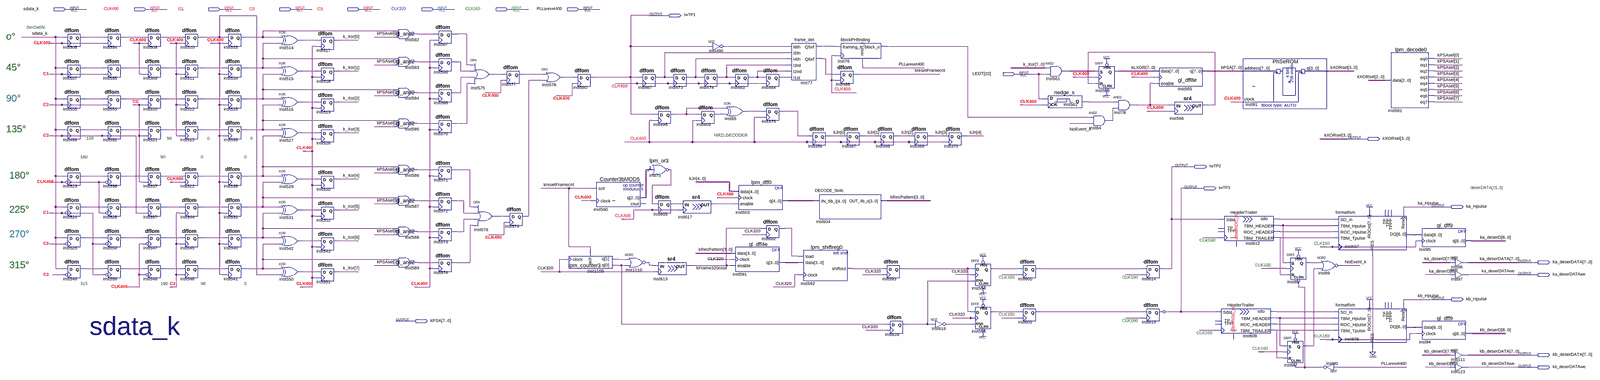
[diagram p0: schematic sheet, whole]
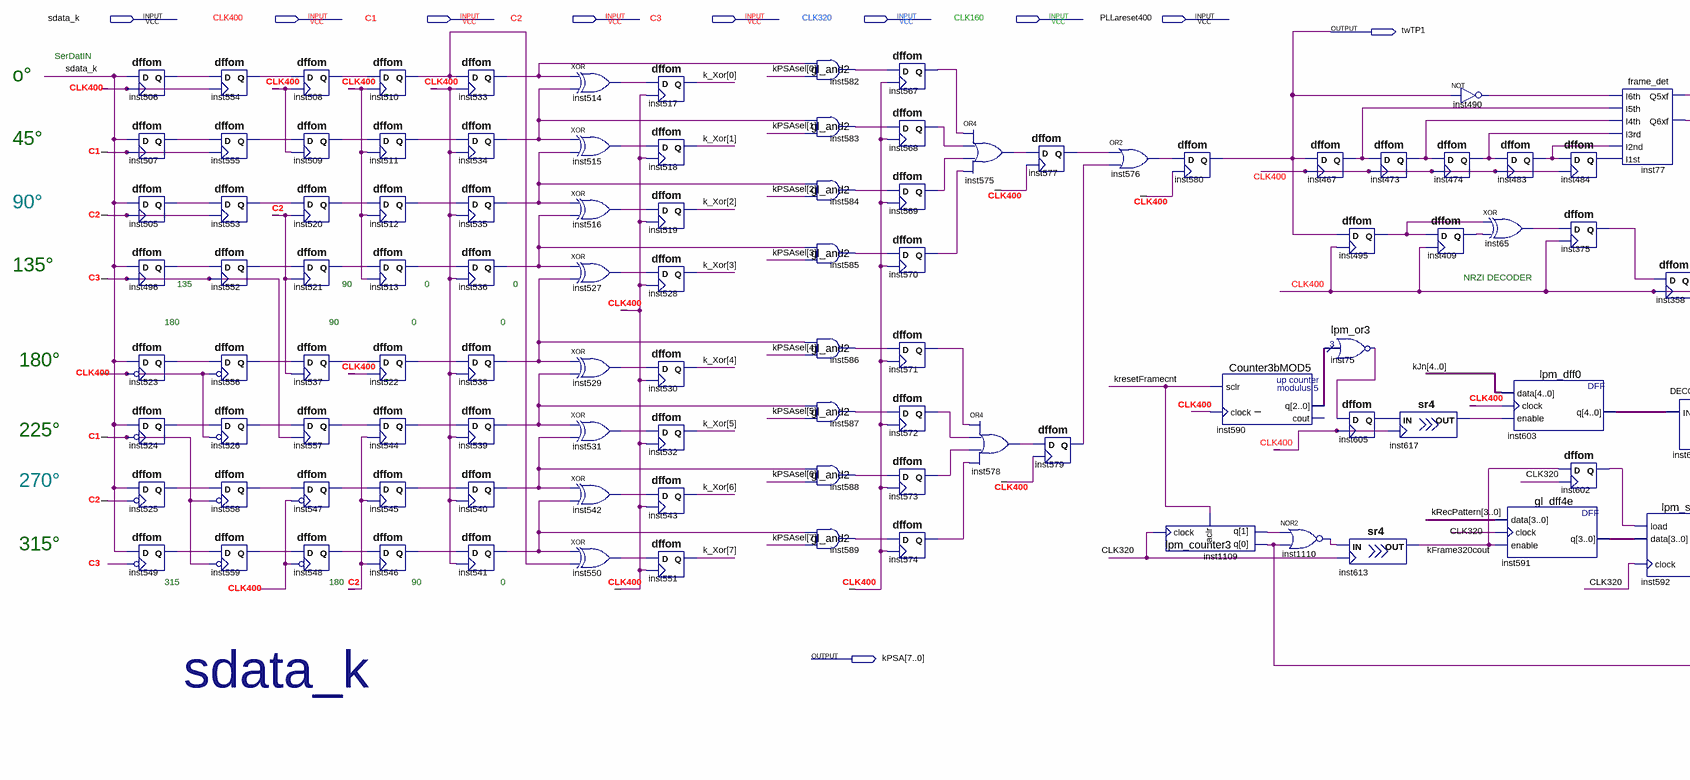
[diagram p1: schematic sheet, left part]
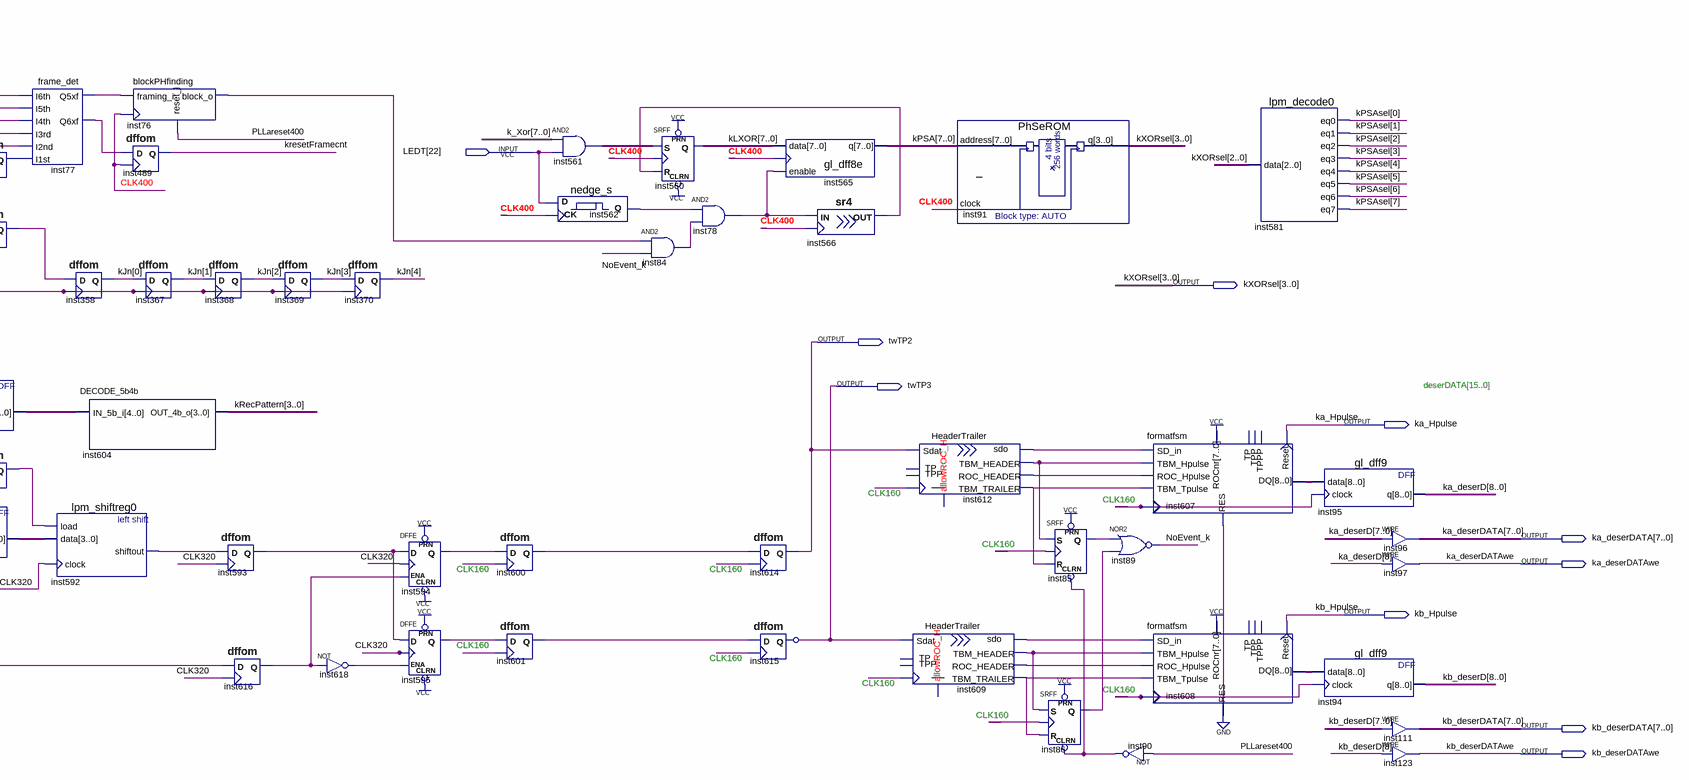
[diagram p2: schematic sheet, right part]
// Quartus schematic deser400_inst_k.bdf as structural Verilog: 140 symbols, 20 pins
module deser400_inst_k (
  input  sdata_k,
  input  CLK400,
  input  C1,
  input  C2,
  input  C3,
  input  CLK320,
  input  CLK160,
  input  PLLareset400,
  input  [22:22] LEDT,
  output twTP1,
  output [3:0] kXORsel,
  output twTP2,
  output twTP3,
  output ka_Hpulse,
  output [7:0] ka_deserDATA,
  output ka_deserDATAwe,
  output kb_Hpulse,
  output [7:0] kPSA,
  output [7:0] kb_deserDATA,
  output kb_deserDATAwe
);

  wire inst65_out, inst75_result, inst75_result_inverted_out, inst76_block_o, inst77_q5xf, inst77_q6xf,
       inst78_out, inst84_out, inst85_q, inst86_q, inst90_out, inst375_q, inst409_q, inst467_q, inst473_q,
       inst474_q, inst483_q, inst484_q, inst490_out, inst495_q, inst496_q, inst505_q, inst506_q, inst507_q,
       inst508_q, inst509_q, inst510_q, inst511_q, inst512_q, inst513_q, inst514_out, inst515_out,
       inst516_out, inst520_q, inst521_q, inst522_q, inst523_q, inst524_q, inst525_q, inst526_q, inst527_out,
       inst529_out, inst531_out, inst533_q, inst534_q, inst535_q, inst536_q, inst537_q, inst538_q, inst539_q,
       inst540_q, inst541_q, inst542_out, inst544_q, inst545_q, inst546_q, inst547_q, inst548_q, inst549_q,
       inst550_out, inst552_q, inst553_q, inst554_q, inst555_q, inst556_q, inst557_q, inst558_q, inst559_q,
       inst562_q, inst566_out, inst567_q, inst568_q, inst569_q, inst570_q, inst571_q, inst572_q, inst573_q,
       inst574_q, inst575_out, inst576_out, inst577_q, inst578_out, inst579_q, inst582_result,
       inst583_result, inst584_result, inst585_result, inst586_result, inst587_result, inst588_result,
       inst589_result, inst592_shiftout, inst593_q, inst594_q, inst595_q, inst600_q, inst601_q, inst602_q,
       inst605_q, inst609_roc_header, inst609_sdo, inst609_tbm_header, inst609_tbm_trailer,
       inst612_roc_header, inst612_sdo, inst612_tbm_header, inst612_tbm_trailer, inst615_q, inst616_q,
       inst617_out, inst618_out, inst1109_q, inst1109_q_2, inst1110_out, kFrame320cout, kresetFramecnt,
       NoEvent_k;
  wire [2:0] inst590_q;
  wire [3:0] inst591_q, kRecPattern;
  wire [4:0] inst603_q, kJn;
  wire [7:0] inst561_out, k_Xor, kLXOR, kPSAsel;
  wire [8:0] inst607_dq, inst608_dq, ka_deserD, kb_deserD;

  dffom inst506 (.D(sdata_k), .CK(CLK400), .Q(inst506_q));
  dffom inst507 (.D(sdata_k), .CK(C1), .Q(inst507_q));
  dffom inst505 (.D(sdata_k), .CK(C2), .Q(inst505_q));
  dffom inst496 (.D(sdata_k), .CK(C3), .Q(inst496_q));
  dffom inst523 (.D(sdata_k), .CK(~CLK400), .Q(inst523_q));
  dffom inst524 (.D(sdata_k), .CK(~C1), .Q(inst524_q));
  dffom inst525 (.D(sdata_k), .CK(~C2), .Q(inst525_q));
  dffom inst549 (.D(sdata_k), .CK(~C3), .Q(inst549_q));
  dffom inst554 (.D(inst506_q), .CK(CLK400), .Q(inst554_q));
  dffom inst555 (.D(inst507_q), .CK(C1), .Q(inst555_q));
  dffom inst553 (.D(inst505_q), .CK(C2), .Q(inst553_q));
  dffom inst552 (.D(inst496_q), .CK(C3), .Q(inst552_q));
  dffom inst556 (.D(inst523_q), .CK(~CLK400), .Q(inst556_q));
  dffom inst526 (.D(inst524_q), .CK(~CLK400), .Q(inst526_q));
  dffom inst558 (.D(inst525_q), .CK(~C1), .Q(inst558_q));
  dffom inst559 (.D(inst549_q), .CK(~C1), .Q(inst559_q));
  dffom inst508 (.D(inst554_q), .CK(CLK400), .Q(inst508_q));
  dffom inst509 (.D(inst555_q), .CK(CLK400), .Q(inst509_q));
  dffom inst520 (.D(inst553_q), .CK(C2), .Q(inst520_q));
  dffom inst521 (.D(inst552_q), .CK(C2), .Q(inst521_q));
  dffom inst537 (.D(inst556_q), .CK(C2), .Q(inst537_q));
  dffom inst557 (.D(inst526_q), .CK(C3), .Q(inst557_q));
  dffom inst547 (.D(inst558_q), .CK(~CLK400), .Q(inst547_q));
  dffom inst548 (.D(inst559_q), .CK(~CLK400), .Q(inst548_q));
  dffom inst510 (.D(inst508_q), .CK(CLK400), .Q(inst510_q));
  dffom inst511 (.D(inst509_q), .CK(CLK400), .Q(inst511_q));
  dffom inst512 (.D(inst520_q), .CK(CLK400), .Q(inst512_q));
  dffom inst513 (.D(inst521_q), .CK(CLK400), .Q(inst513_q));
  dffom inst522 (.D(inst537_q), .CK(CLK400), .Q(inst522_q));
  dffom inst544 (.D(inst557_q), .CK(C2), .Q(inst544_q));
  dffom inst545 (.D(inst547_q), .CK(C2), .Q(inst545_q));
  dffom inst546 (.D(inst548_q), .CK(C2), .Q(inst546_q));
  dffom inst533 (.D(inst510_q), .CK(CLK400), .Q(inst533_q));
  dffom inst534 (.D(inst511_q), .CK(CLK400), .Q(inst534_q));
  dffom inst535 (.D(inst512_q), .CK(CLK400), .Q(inst535_q));
  dffom inst536 (.D(inst513_q), .CK(CLK400), .Q(inst536_q));
  dffom inst538 (.D(inst522_q), .CK(CLK400), .Q(inst538_q));
  dffom inst539 (.D(inst544_q), .CK(CLK400), .Q(inst539_q));
  dffom inst540 (.D(inst545_q), .CK(CLK400), .Q(inst540_q));
  dffom inst541 (.D(inst546_q), .CK(CLK400), .Q(inst541_q));
  xor inst514 (inst514_out, inst533_q, inst534_q);
  xor inst515 (inst515_out, inst534_q, inst535_q);
  xor inst516 (inst516_out, inst535_q, inst536_q);
  xor inst527 (inst527_out, inst536_q, inst538_q);
  xor inst529 (inst529_out, inst538_q, inst539_q);
  xor inst531 (inst531_out, inst539_q, inst540_q);
  xor inst542 (inst542_out, inst540_q, inst541_q);
  xor inst550 (inst550_out, inst541_q, inst510_q);
  dffom inst517 (.D(inst514_out), .CK(CLK400), .Q(k_Xor[0]));
  dffom inst518 (.D(inst515_out), .CK(CLK400), .Q(k_Xor[1]));
  dffom inst519 (.D(inst516_out), .CK(CLK400), .Q(k_Xor[2]));
  dffom inst528 (.D(inst527_out), .CK(CLK400), .Q(k_Xor[3]));
  dffom inst530 (.D(inst529_out), .CK(CLK400), .Q(k_Xor[4]));
  dffom inst532 (.D(inst531_out), .CK(CLK400), .Q(k_Xor[5]));
  dffom inst543 (.D(inst542_out), .CK(CLK400), .Q(k_Xor[6]));
  dffom inst551 (.D(inst550_out), .CK(CLK400), .Q(k_Xor[7]));
  gl_and2 inst582 (.data0(inst533_q), .data1(kPSAsel[0]), .result(inst582_result));
  gl_and2 inst583 (.data0(inst534_q), .data1(kPSAsel[1]), .result(inst583_result));
  gl_and2 inst584 (.data0(inst535_q), .data1(kPSAsel[2]), .result(inst584_result));
  gl_and2 inst585 (.data0(inst536_q), .data1(kPSAsel[3]), .result(inst585_result));
  gl_and2 inst586 (.data0(inst538_q), .data1(kPSAsel[4]), .result(inst586_result));
  gl_and2 inst587 (.data0(inst539_q), .data1(kPSAsel[5]), .result(inst587_result));
  gl_and2 inst588 (.data0(inst540_q), .data1(kPSAsel[6]), .result(inst588_result));
  gl_and2 inst589 (.data0(inst541_q), .data1(kPSAsel[7]), .result(inst589_result));
  dffom inst567 (.D(inst582_result), .CK(CLK400), .Q(inst567_q));
  dffom inst568 (.D(inst583_result), .CK(CLK400), .Q(inst568_q));
  dffom inst569 (.D(inst584_result), .CK(CLK400), .Q(inst569_q));
  dffom inst570 (.D(inst585_result), .CK(CLK400), .Q(inst570_q));
  dffom inst571 (.D(inst586_result), .CK(CLK400), .Q(inst571_q));
  dffom inst572 (.D(inst587_result), .CK(CLK400), .Q(inst572_q));
  dffom inst573 (.D(inst588_result), .CK(CLK400), .Q(inst573_q));
  dffom inst574 (.D(inst589_result), .CK(CLK400), .Q(inst574_q));
  or inst575 (inst575_out, inst567_q, inst568_q, inst569_q, inst570_q);
  or inst578 (inst578_out, inst571_q, inst572_q, inst573_q, inst574_q);
  dffom inst577 (.D(inst575_out), .CK(CLK400), .Q(inst577_q));
  dffom inst579 (.D(inst578_out), .CK(CLK400), .Q(inst579_q));
  or inst576 (inst576_out, inst577_q, inst579_q);
  dffom inst580 (.D(inst576_out), .CK(CLK400), .Q(twTP1));
  lpm_counter3 inst1109 (.clock(CLK320), .aclr(kresetFramecnt), .q({inst1109_q, inst1109_q_2}));
  Counter3bMOD5 inst590 (.sclr(kresetFramecnt), .clock(CLK400), .q(inst590_q));  // open: cout
  nor inst1110 (inst1110_out, inst1109_q, inst1109_q_2);
  dffom inst467 (.D(twTP1), .CK(CLK400), .Q(inst467_q));
  dffom inst495 (.D(twTP1), .CK(CLK400), .Q(inst495_q));
  lpm_or3 inst75 (.data(inst590_q), .result(inst75_result));
  not inst75_result_inverted (inst75_result_inverted_out, inst75_result);
  dffom inst605 (.D(inst75_result_inverted_out), .CK(CLK400), .Q(inst605_q));
  sr4 inst613 (.IN(inst1110_out), .CLK(CLK320), .OUT(kFrame320cout));
  dffom inst473 (.D(inst467_q), .CK(CLK400), .Q(inst473_q));
  sr4 inst617 (.IN(inst605_q), .CLK(CLK400), .OUT(inst617_out));
  dffom inst474 (.D(inst473_q), .CK(CLK400), .Q(inst474_q));
  dffom inst409 (.D(inst495_q), .CK(CLK400), .Q(inst409_q));
  not inst490 (inst490_out, twTP1);
  dffom inst483 (.D(inst474_q), .CK(CLK400), .Q(inst483_q));
  xor inst65 (inst65_out, inst495_q, inst409_q);
  gl_dff4e inst591 (.data(kRecPattern), .clock(CLK320), .enable(kFrame320cout), .q(inst591_q));
  lpm_dff0 inst603 (.data(kJn), .clock(CLK400), .enable(inst617_out), .q(inst603_q));
  dffom inst484 (.D(inst483_q), .CK(CLK400), .Q(inst484_q));
  dffom inst375 (.D(inst65_out), .CK(CLK400), .Q(inst375_q));
  dffom inst602 (.D(kFrame320cout), .CK(CLK320), .Q(inst602_q));
  frame_det inst77 (
    .I1st(inst484_q), .I2nd(inst483_q), .I3rd(inst474_q), .I4th(inst473_q), .I5th(inst467_q),
    .I6th(inst490_out), .Q5xf(inst77_q5xf), .Q6xf(inst77_q6xf));
  lpm_shiftreg0 inst592 (.load(inst602_q), .data(inst591_q), .clock(CLK320), .shiftout(inst592_shiftout));
  dffom inst358 (.D(inst375_q), .CK(CLK400), .Q(kJn[0]));
  DECODE_5b4b inst604 (.IN_5b_i(inst603_q), .OUT_4b_o(kRecPattern));
  blockPHfinding inst76 (.reset_i(PLLareset400), .framing_i(inst77_q5xf), .clk_i(CLK400), .block_o(inst76_block_o));
  dffom inst489 (.D(inst77_q6xf), .CK(CLK400), .Q(kresetFramecnt));
  dffom inst367 (.D(kJn[0]), .CK(CLK400), .Q(kJn[1]));
  dffom inst368 (.D(kJn[1]), .CK(CLK400), .Q(kJn[2]));
  dffom inst593 (.D(inst592_shiftout), .CK(CLK320), .Q(inst593_q));
  dffom inst616 (.D(inst1109_q_2), .CK(CLK320), .Q(inst616_q));
  dffom inst369 (.D(kJn[2]), .CK(CLK400), .Q(kJn[3]));
  dffom inst370 (.D(kJn[3]), .CK(CLK400), .Q(kJn[4]));
  not inst618 (inst618_out, inst616_q);
  DFFE inst594 (.PRN(1'b1), .CLRN(1'b1), .D(inst593_q), .CLK(CLK320), .ENA(inst616_q), .Q(inst594_q));
  DFFE inst595 (.PRN(1'b1), .CLRN(1'b1), .D(inst593_q), .CLK(CLK320), .ENA(inst618_out), .Q(inst595_q));
  dffom inst600 (.D(inst594_q), .CK(CLK160), .Q(inst600_q));
  dffom inst601 (.D(inst595_q), .CK(CLK160), .Q(inst601_q));
  assign inst561_out = k_Xor & {8{LEDT[22]}};  // AND2 inst561, 8 bits wide
  nedge_s inst562 (.D(LEDT[22]), .CK(CLK400), .Q(inst562_q));
  SRFF inst560[7:0] (.PRN(1'b1), .CLRN(1'b1), .S(inst561_out), .R(inst566_out), .CLK(CLK400), .Q(kLXOR));
  and inst84 (inst84_out, inst76_block_o, NoEvent_k);
  and inst78 (inst78_out, inst562_q, inst84_out);
  dffom inst614 (.D(inst600_q), .CK(CLK160), .Q(twTP2));
  dffom inst615 (.D(inst601_q), .CK(CLK160), .Q(inst615_q));
  not inst615_Q_inverted (twTP3, inst615_q);
  gl_dff8e inst565 (.data(kLXOR), .enable(inst78_out), .clock(CLK400), .q(kPSA));
  sr4 inst566 (.IN(inst78_out), .CLK(CLK400), .OUT(inst566_out));
  HeaderTrailer inst612 (
    .Sdat(twTP2), .CLK(CLK160), .TBM_HEADER(inst612_tbm_header), .ROC_HEADER(inst612_roc_header),
    .TBM_TRAILER(inst612_tbm_trailer), .sdo(inst612_sdo));  // open: allowROC_H, TP, TPP
  HeaderTrailer inst609 (
    .Sdat(twTP3), .CLK(CLK160), .TBM_HEADER(inst609_tbm_header), .ROC_HEADER(inst609_roc_header),
    .TBM_TRAILER(inst609_tbm_trailer), .sdo(inst609_sdo));  // open: allowROC_H, TP, TPP
  PhSeROM inst91 (.address(kPSA), .clock(CLK400), .q(kXORsel));
  SRFF inst85 (
    .PRN(1'b1), .CLRN(inst90_out), .S(inst612_tbm_header), .R(inst612_tbm_trailer), .CLK(CLK160), .Q(inst85_q));
  SRFF inst86 (
    .PRN(1'b1), .CLRN(inst90_out), .S(inst609_tbm_header), .R(inst609_tbm_trailer), .CLK(CLK160), .Q(inst86_q));
  nor inst89 (NoEvent_k, inst85_q, inst86_q);
  not inst90 (inst90_out, PLLareset400);
  formatfsm inst607 (
    .TBM_Hpulse(inst612_tbm_header), .ROC_Hpulse(inst612_roc_header), .TBM_Tpulse(inst612_tbm_trailer),
    .SD_in(inst612_sdo), .RES(1'b0), .ROCnr({8{1'b1}}), .CLK160(CLK160), .DQ(inst607_dq), .Reset(ka_Hpulse));  // open: TPPP, TPP, TP
  formatfsm inst608 (
    .TBM_Hpulse(inst609_tbm_header), .ROC_Hpulse(inst609_roc_header), .TBM_Tpulse(inst609_tbm_trailer),
    .SD_in(inst609_sdo), .RES(1'b0), .ROCnr({8{1'b1}}), .CLK160(CLK160), .DQ(inst608_dq), .Reset(kb_Hpulse));  // open: TPPP, TPP, TP
  lpm_decode0 inst581 (
    .data(kXORsel[2:0]), .eq0(kPSAsel[0]), .eq1(kPSAsel[1]), .eq2(kPSAsel[2]), .eq3(kPSAsel[3]),
    .eq4(kPSAsel[4]), .eq5(kPSAsel[5]), .eq6(kPSAsel[6]), .eq7(kPSAsel[7]));
  gl_dff9 inst95 (.clock(CLK160), .data(inst607_dq), .q(ka_deserD));
  gl_dff9 inst94 (.data(inst608_dq), .clock(CLK160), .q(kb_deserD));
  assign ka_deserDATA = ka_deserD[7:0];  // WIRE inst96
  assign ka_deserDATAwe = ka_deserD[8];  // WIRE inst97
  assign kb_deserDATA = kb_deserD[7:0];  // WIRE inst111
  assign kb_deserDATAwe = kb_deserD[8];  // WIRE inst123

  // Notes on the sheet:
  //   SerDatIN
  //   o°
  //   -
  //   45°
  //   90°
  //   135°
  //   NRZI DECODER
  //   135
  //   90
  //   0
  //   0
  //   180
  //   90
  //   0
  //   0
  //   180°
  //   -
  //   deserDATA[15..0]
  //   225°
  //   270°
  //   315°
  //   315
  //   180
  //   90
  //   0
  //   sdata_k
endmodule
